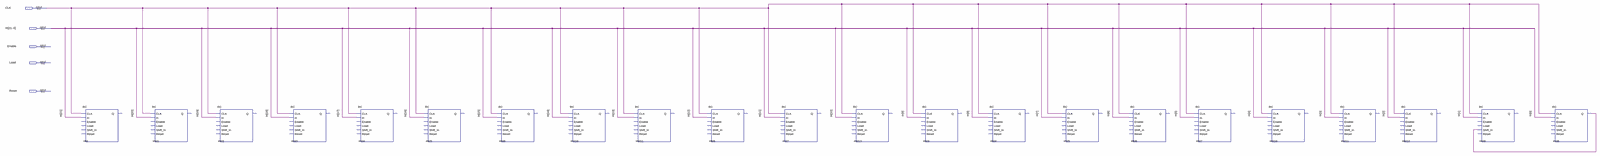
[diagram p0: schematic sheet, whole]
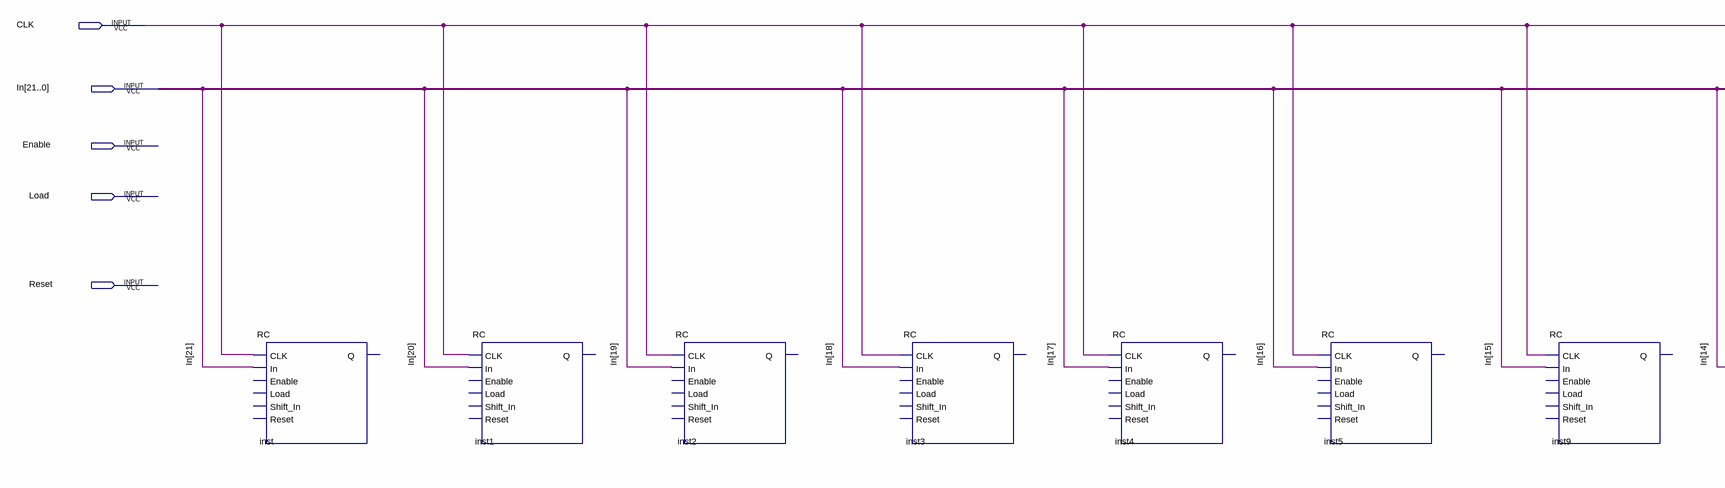
[diagram p1: schematic sheet, left part]
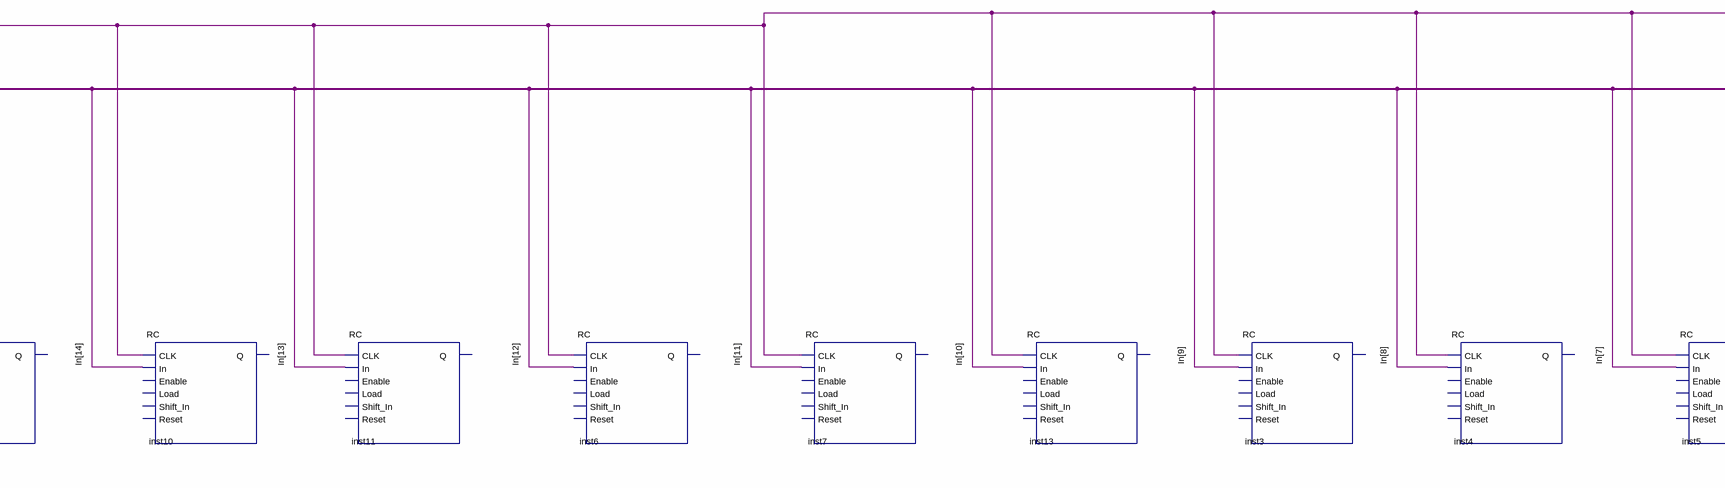
[diagram p2: schematic sheet, centre part]
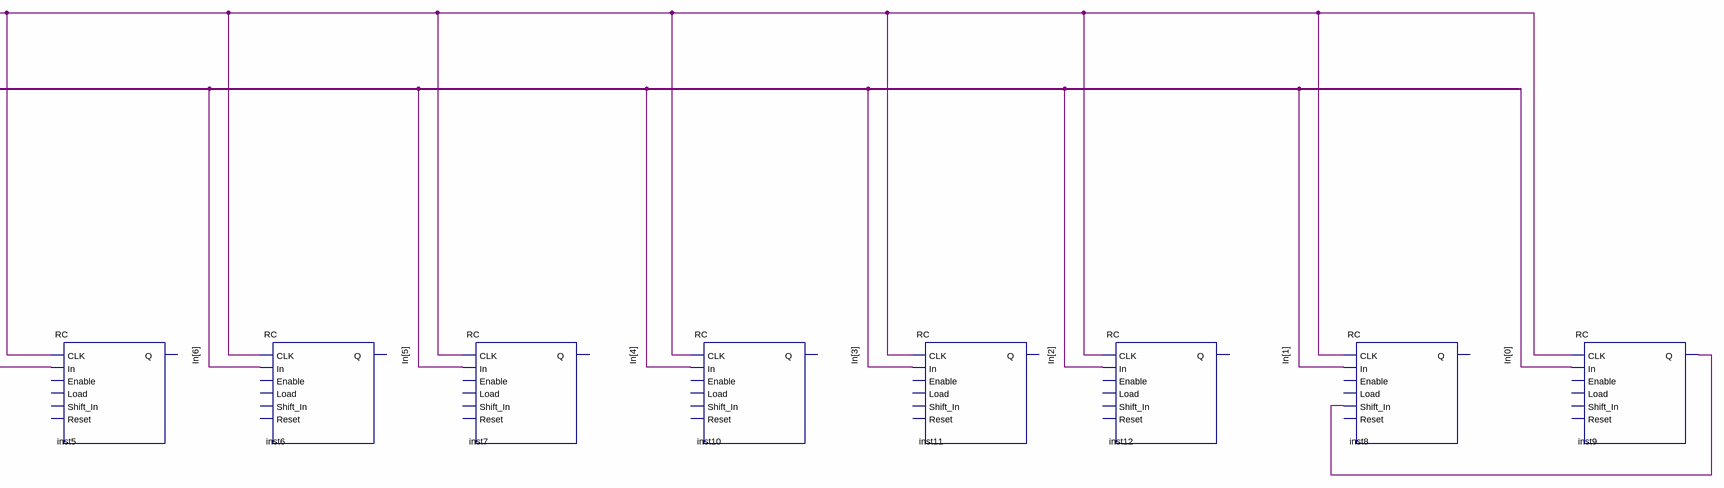
[diagram p3: schematic sheet, right part]
// Quartus schematic ShiftLeftReg.bdf as structural Verilog: 22 symbols, 5 pins
module ShiftLeftReg (
  input  CLK,
  input  [21:0] In,
  input  Enable,
  input  Load,
  input  Reset
);

  wire inst9_q;

  RC inst (.CLK(CLK), .In(In[21]));  // open: Enable, Load, Shift_In, Reset, Q
  RC inst1 (.CLK(CLK), .In(In[20]));  // open: Enable, Load, Shift_In, Reset, Q
  RC inst2 (.CLK(CLK), .In(In[19]));  // open: Enable, Load, Shift_In, Reset, Q
  RC inst3 (.CLK(CLK), .In(In[18]));  // open: Enable, Load, Shift_In, Reset, Q
  RC inst4 (.CLK(CLK), .In(In[17]));  // open: Enable, Load, Shift_In, Reset, Q
  RC inst5 (.CLK(CLK), .In(In[16]));  // open: Enable, Load, Shift_In, Reset, Q
  RC inst9 (.CLK(CLK), .In(In[15]));  // open: Enable, Load, Shift_In, Reset, Q
  RC inst10 (.CLK(CLK), .In(In[14]));  // open: Enable, Load, Shift_In, Reset, Q
  RC inst11 (.CLK(CLK), .In(In[13]));  // open: Enable, Load, Shift_In, Reset, Q
  RC inst6 (.CLK(CLK), .In(In[12]));  // open: Enable, Load, Shift_In, Reset, Q
  RC inst7 (.CLK(CLK), .In(In[11]));  // open: Enable, Load, Shift_In, Reset, Q
  RC inst13 (.CLK(CLK), .In(In[10]));  // open: Enable, Load, Shift_In, Reset, Q
  RC inst3_dup2 (.CLK(CLK), .In(In[9]));  // open: Enable, Load, Shift_In, Reset, Q
  RC inst4_dup2 (.CLK(CLK), .In(In[8]));  // open: Enable, Load, Shift_In, Reset, Q
  RC inst5_dup2 (.CLK(CLK), .In(In[7]));  // open: Enable, Load, Shift_In, Reset, Q
  RC inst6_dup2 (.CLK(CLK), .In(In[6]));  // open: Enable, Load, Shift_In, Reset, Q
  RC inst7_dup2 (.CLK(CLK), .In(In[5]));  // open: Enable, Load, Shift_In, Reset, Q
  RC inst10_dup2 (.CLK(CLK), .In(In[4]));  // open: Enable, Load, Shift_In, Reset, Q
  RC inst11_dup2 (.CLK(CLK), .In(In[3]));  // open: Enable, Load, Shift_In, Reset, Q
  RC inst12 (.CLK(CLK), .In(In[2]));  // open: Enable, Load, Shift_In, Reset, Q
  RC inst8 (.CLK(CLK), .In(In[1]), .Shift_In(inst9_q));  // open: Enable, Load, Reset, Q
  RC inst9_dup2 (.CLK(CLK), .In(In[0]), .Q(inst9_q));  // open: Enable, Load, Shift_In, Reset
endmodule
